# Altium schematic sheet I2C Expanders.SchDoc
size A3
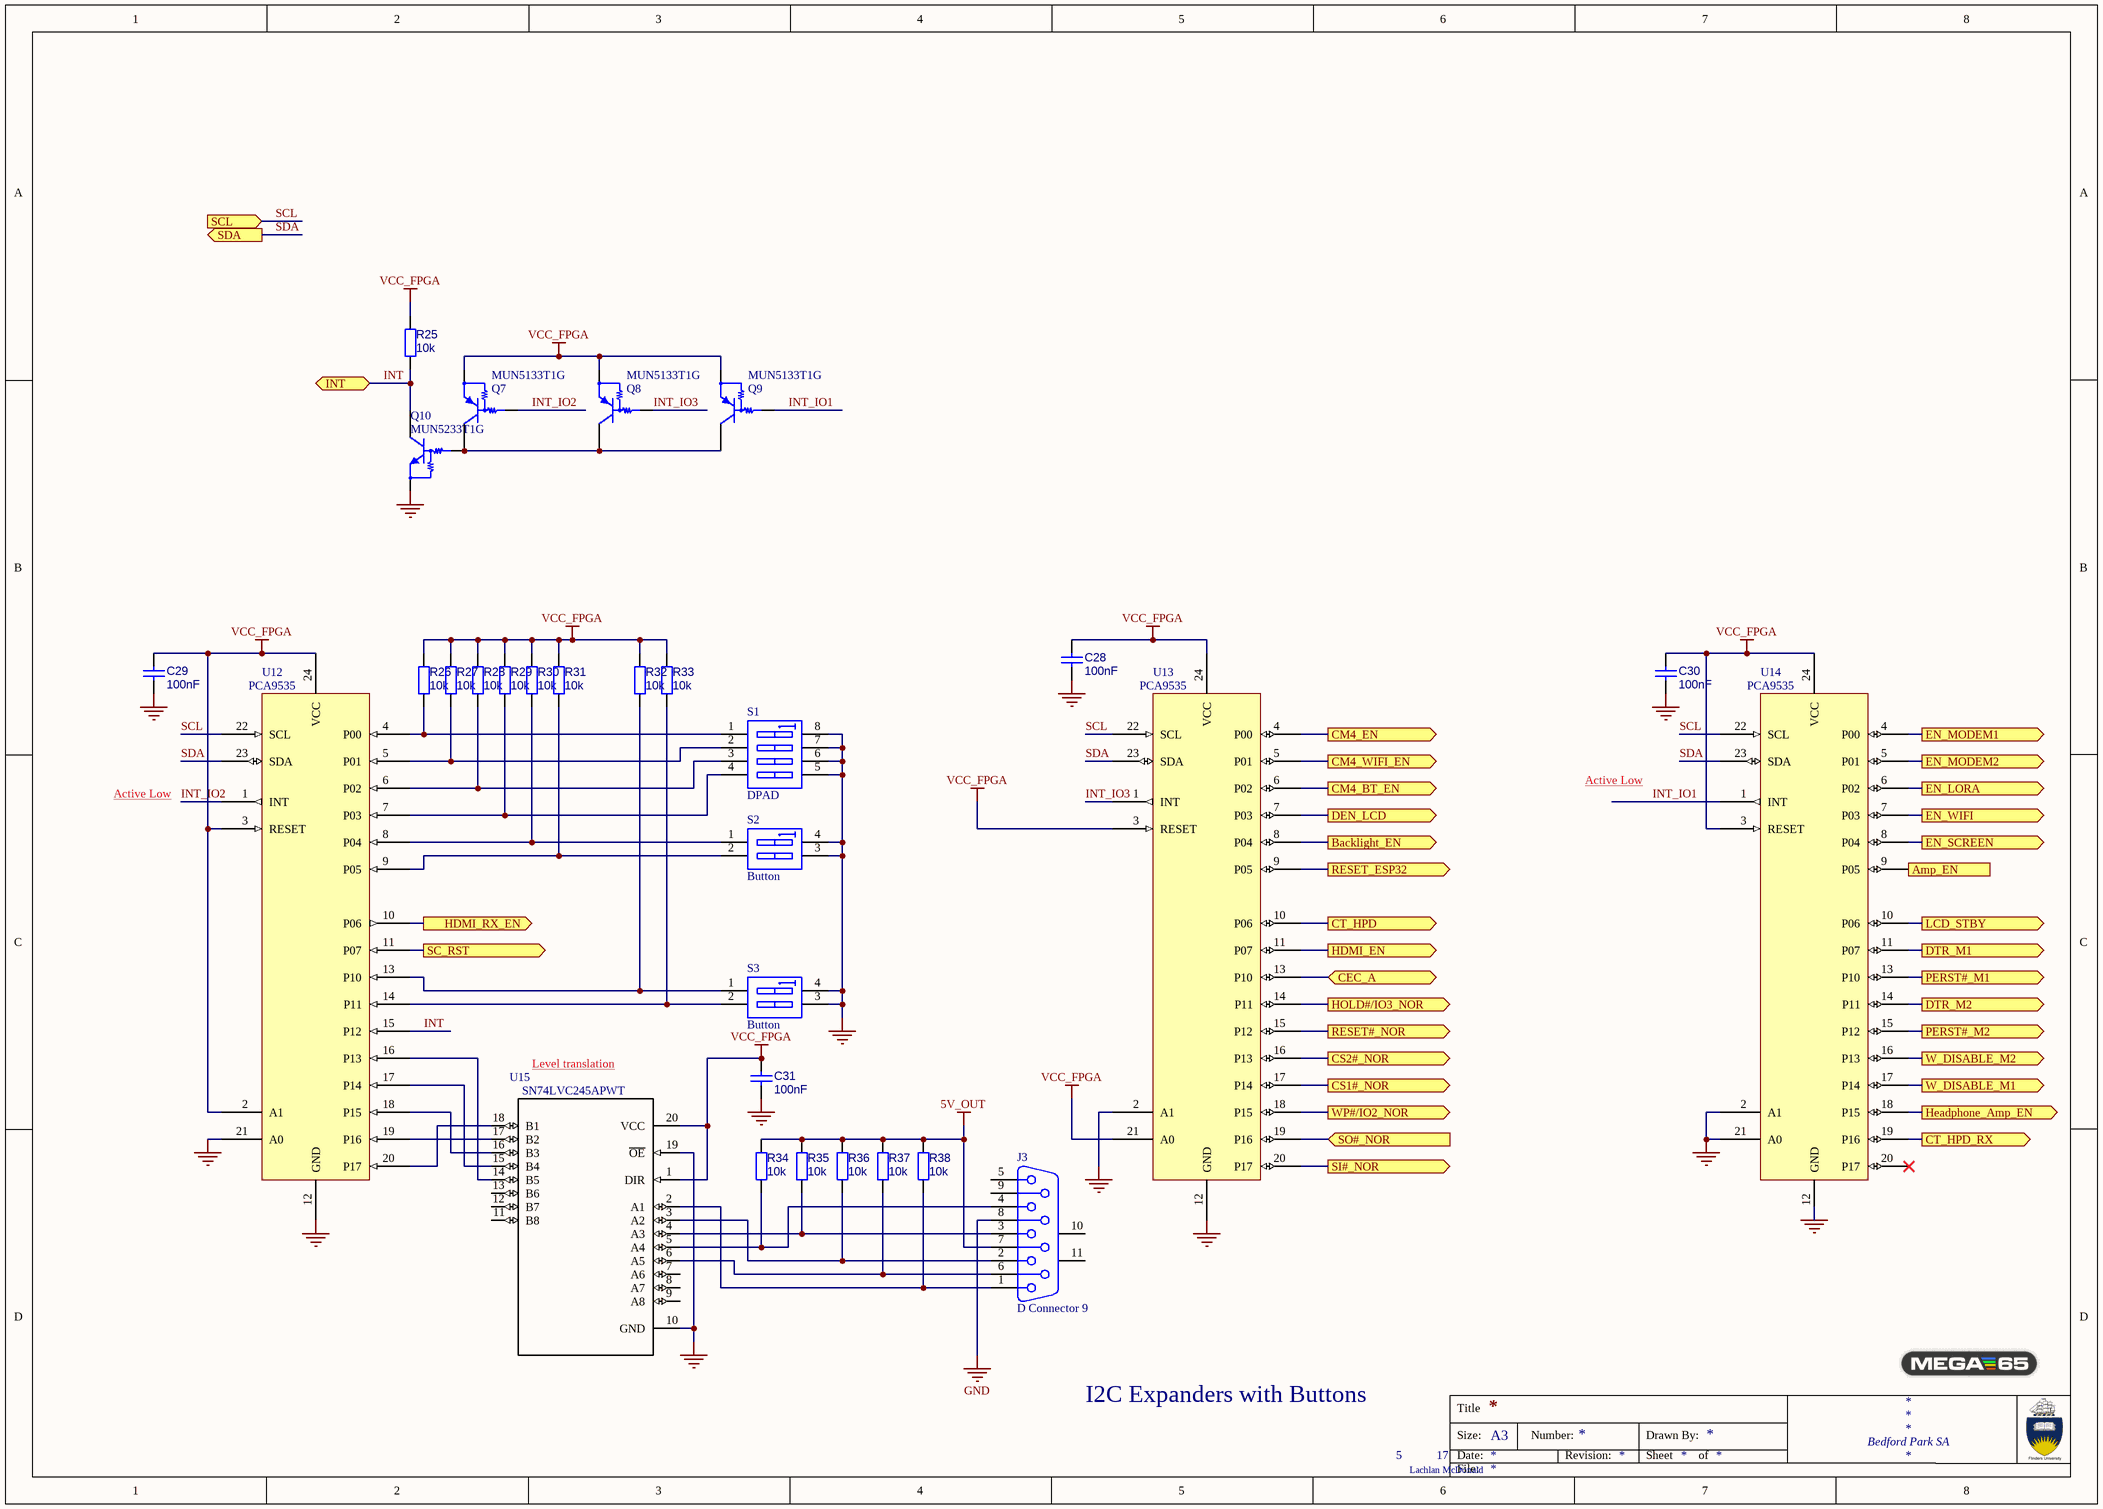
[diagram p0: I2C Expanders.SchDoc]

## Parts
C28  100nF  [0603_CAP UF HD]
C29  100nF  [0603_CAP UF HD]
C30  100nF  [0603_CAP UF HD]
C31  100nF  [0603_CAP UF HD]
J3  D Connector 9  [DB9 Right Angle Through-Hole Male]
Q7  MUN5133T1G  [SC70-3 (SOT-323)]
Q8  MUN5133T1G  [SC70-3 (SOT-323)]
Q9  MUN5133T1G  [SC70-3 (SOT-323)]
Q10  MUN5233T1G  [SC70-3 (SOT-323)]
R25  10k  [0603-RESISTOR HD]
R26  10k  [0603-RESISTOR HD]
R27  10k  [0603-RESISTOR HD]
R28  10k  [0603-RESISTOR HD]
R29  10k  [0603-RESISTOR HD]
R30  10k  [0603-RESISTOR HD]
R31  10k  [0603-RESISTOR HD]
R32  10k  [0603-RESISTOR HD]
R33  10k  [0603-RESISTOR HD]
R34  10k  [0603-RESISTOR HD]
R35  10k  [0603-RESISTOR HD]
R36  10k  [0603-RESISTOR HD]
R37  10k  [0603-RESISTOR HD]
R38  10k  [0603-RESISTOR HD]
S1  DPAD  [DPAD Gameboy V2]
S2  Button  [Buttons Gameboy v2]
S3  Button  [Buttons Gameboy v2]
U12  PCA9535  [PW0024A_M]
U13  PCA9535  [PW0024A_M]
U14  PCA9535  [PW0024A_M]
U15  SN74LVC245APWT  [DGV20_M]

## Ports
Amp_EN (out), Backlight_EN (out), CEC_A (bidir), CM4_BT_EN (out), CM4_EN (out), CM4_WIFI_EN (out), CS1#_NOR (out), CS2#_NOR (out), CT_HPD (out), CT_HPD_RX (out), DEN_LCD (out), DTR_M1 (out), DTR_M2 (out), EN_LORA (out), EN_MODEM1 (out), EN_MODEM2 (out), EN_SCREEN (out), EN_WIFI (out), HDMI_EN (out), HDMI_RX_EN (out), Headphone_Amp_EN (out), HOLD#/IO3_NOR (out), INT (bidir), LCD_STBY (out), PERST#_M1 (out), PERST#_M2 (out), RESET#_NOR (out), RESET_ESP32 (out), SC_RST (out), SCL (in), SDA (out), SI#_NOR (out), SO#_NOR (in), W_DISABLE_M1 (out), W_DISABLE_M2 (out), WP#/IO2_NOR (out)

## Nets
5V_OUT: J3.7 R34.1 R35.1 R36.1 R37.1 R38.1
GND: C28.2 C29.2 C30.2 C31.2 J3.8 Q10.1(E) S1.5(B4) S1.6(B3) S1.7(B2) S1.8(B1) S2.3(B2) S2.4(B1) S3.3(B2) S3.4(B1) U12.12(GND) U12.21(A0) U13.2(A1) U13.12(GND) U14.2(A1) U14.12(GND) U14.21(A0) U15.10(GND) U15.19(~{OE})
VCC_FPGA: C28.1 C29.1 C30.1 C31.1 Q7.2(E) Q8.2(E) Q9.2(E) R25.2 R26.1 R27.1 R28.1 R29.1 R30.1 R31.1 R32.1 R33.1 U12.2(A1) U12.3(RESET) U12.24(VCC) U13.3(RESET) U13.21(A0) U13.24(VCC) U14.3(RESET) U14.24(VCC) U15.1(DIR) U15.20(VCC)
Amp_EN: U14.9(P05) ; port Amp_EN
Backlight_EN: U13.8(P04) ; port Backlight_EN
CEC_A: U13.13(P10) ; port CEC_A
CM4_BT_EN: U13.6(P02) ; port CM4_BT_EN
CM4_EN: U13.4(P00) ; port CM4_EN
CM4_WIFI_EN: U13.5(P01) ; port CM4_WIFI_EN
CS1#_NOR: U13.17(P14) ; port CS1#_NOR
CS2#_NOR: U13.16(P13) ; port CS2#_NOR
CT_HPD: U13.10(P06) ; port CT_HPD
CT_HPD_RX: U14.19(P16) ; port CT_HPD_RX
DEN_LCD: U13.7(P03) ; port DEN_LCD
DTR_M1: U14.11(P07) ; port DTR_M1
DTR_M2: U14.14(P11) ; port DTR_M2
EN_LORA: U14.6(P02) ; port EN_LORA
EN_MODEM1: U14.4(P00) ; port EN_MODEM1
EN_MODEM2: U14.5(P01) ; port EN_MODEM2
EN_SCREEN: U14.8(P04) ; port EN_SCREEN
EN_WIFI: U14.7(P03) ; port EN_WIFI
HDMI_EN: U13.11(P07) ; port HDMI_EN
HDMI_RX_EN: U12.10(P06) ; port HDMI_RX_EN
Headphone_Amp_EN: U14.18(P15) ; port Headphone_Amp_EN
HOLD#/IO3_NOR: U13.14(P11) ; port HOLD#/IO3_NOR
INT: Q10.3(C) R25.1 U12.15(P12) ; port INT
INT_IO1: Q9.1(B) U14.1(INT)
INT_IO2: Q7.1(B) U12.1(INT)
INT_IO3: Q8.1(B) U13.1(INT)
LCD_STBY: U14.10(P06) ; port LCD_STBY
PERST#_M1: U14.13(P10) ; port PERST#_M1
PERST#_M2: U14.15(P12) ; port PERST#_M2
RESET#_NOR: U13.15(P12) ; port RESET#_NOR
RESET_ESP32: U13.9(P05) ; port RESET_ESP32
SC_RST: U12.11(P07) ; port SC_RST
SCL: U12.22(SCL) U13.22(SCL) U14.22(SCL) ; port SCL
SDA: U12.23(SDA) U13.23(SDA) U14.23(SDA) ; port SDA
SI#_NOR: U13.20(P17) ; port SI#_NOR
SO#_NOR: U13.19(P16) ; port SO#_NOR
W_DISABLE_M1: U14.17(P14) ; port W_DISABLE_M1
W_DISABLE_M2: U14.16(P13) ; port W_DISABLE_M2
WP#/IO2_NOR: U13.18(P15) ; port WP#/IO2_NOR
NetJ3_1: J3.1 R38.2 U15.2(A1)
NetJ3_2: J3.2 R36.2 U15.3(A2)
NetJ3_3: J3.3 R35.2 U15.4(A3)
NetJ3_4: J3.4 R34.2 U15.5(A4)
NetJ3_6: J3.6 R37.2 U15.6(A5)
NetQ7_3: Q7.3(C) Q8.3(C) Q9.3(C) Q10.2(B)
NetR26_2: R26.2 S1.1(A1) U12.4(P00)
NetR27_2: R27.2 S1.2(A2) U12.5(P01)
NetR28_2: R28.2 S1.3(A3) U12.6(P02)
NetR29_2: R29.2 S1.4(A4) U12.7(P03)
NetR30_2: R30.2 S2.1(A1) U12.8(P04)
NetR31_2: R31.2 S2.2(A2) U12.9(P05)
NetR32_2: R32.2 S3.1(A1) U12.13(P10)
NetR33_2: R33.2 S3.2(A2) U12.14(P11)
NetU12_16: U12.16(P13) U15.14(B5)
NetU12_17: U12.17(P14) U15.15(B4)
NetU12_18: U12.18(P15) U15.16(B3)
NetU12_19: U12.19(P16) U15.17(B2)
NetU12_20: U12.20(P17) U15.18(B1)

Not connected (* = marked no-connect by the designer): J3 5 9 10(MH1) 11(MH2); U14 20(P17)*; U15 7(A6) 8(A7) 9(A8) 11(B8) 12(B7) 13(B6)

## Notes on the sheet
- Active Low
- Level translation
- I2C Expanders with Buttons
- 5
- 17
- Lachlan McDonald
- Title
- Size:
- Date:
- A3
- Number:
- Revision:
- Sheet
- Drawn By:
- of
- Bedford Park SA
- File:

## Library data of the parts
C28-C31 = Cap: Capacitor; Value: 100nF
J3 = D Connector 9: Receptacle Assembly, 9 Position, Right Angle; Manufacturer: Assman WSW; Manufacturer Number: A-DS 09 A/KG-T2S; Digikey Number: AE10968-ND
Q7-Q9 = Transistor PNP Prebiased: PNP Bipolar Transistor, Prebiased; Manufacturer: ON Semiconductor; Manufacturer Number: MUN5133T1G; Digikey Number: MUN5133T1GOSCT-ND
Q10 = Transistor NPN Prebiased: NPN Bipolar Transistor, Prebiased; Manufacturer: ON Semiconductor; Manufacturer Number: MUN5233T1G; Digikey Number: MUN5233T1GOSCT-ND
R25-R38 = Resistor: Value: 10k
S1 = SW DIP-4: DIP Switch, 4 Position, SPST
S2 S3 = SW DIP-2: DIP Switch, 2 Position, SPST
U12-U14 = TCA9539: Manufacturer: NXP; Manufacturer Number: PCA9535APW,118; Digikey Number: 568-9913-1-ND
U15 = SN74LVC245APWT: Octal Bus Transceiver With 3-State Outputs 20-TSSOP -40 to 125; Manufacturer: Texas Instruments; Digikey Number: 296-49918-1-ND; Manufacturer Number: SN74LVC245APWT